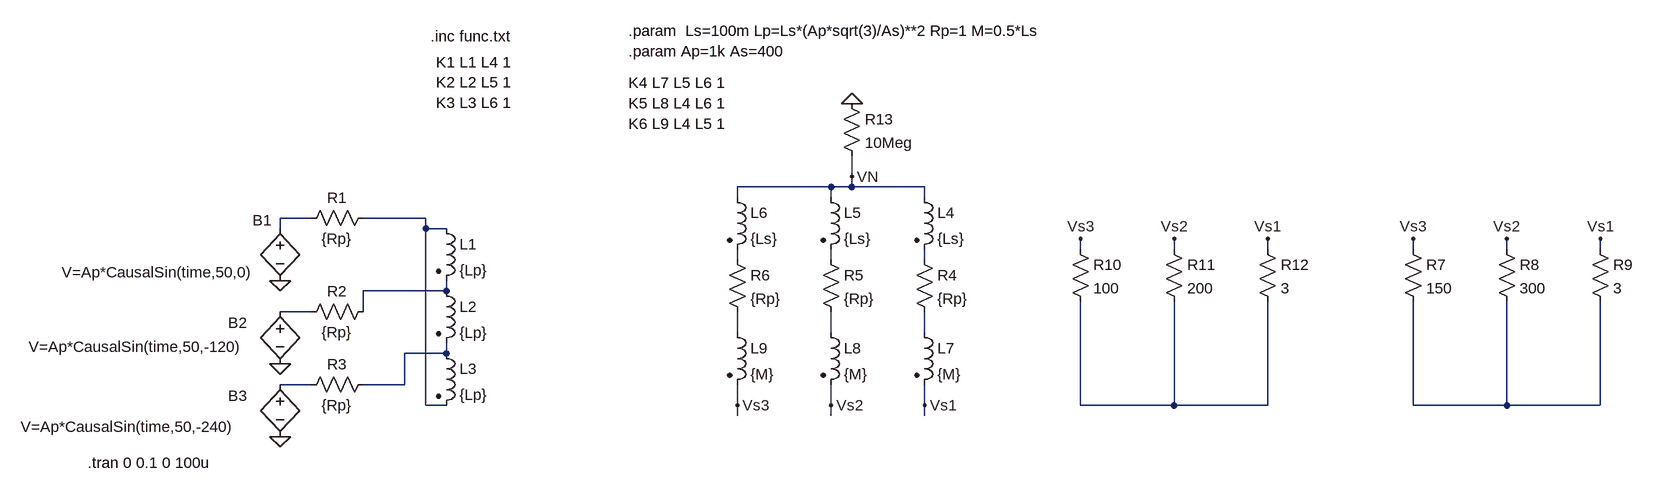
[diagram p0: schematic TransfoTri-Self.asc]
TransfoTri-Self.asc, the LTspice schematic file:
Version 4
SHEET 1 1560 924
WIRE 352 -64 352 -96
WIRE 320 -48 176 -48
WIRE 352 -48 352 -64
WIRE 352 -48 320 -48
WIRE 464 -48 352 -48
WIRE 176 -32 176 -48
WIRE 320 -32 320 -48
WIRE 464 -32 464 -48
WIRE -480 0 -528 0
WIRE -304 0 -400 0
WIRE -528 16 -528 0
WIRE -304 16 -304 0
WIRE -272 16 -304 16
WIRE 704 48 704 32
WIRE 848 48 848 32
WIRE 992 48 992 32
WIRE 1216 48 1216 32
WIRE 1360 48 1360 32
WIRE 1504 48 1504 32
WIRE 176 64 176 48
WIRE 320 64 320 48
WIRE 464 64 464 48
WIRE -272 112 -272 96
WIRE -272 112 -400 112
WIRE -480 144 -528 144
WIRE -400 144 -400 112
WIRE 176 176 176 144
WIRE 320 176 320 144
WIRE 464 176 464 144
WIRE -272 208 -272 192
WIRE -272 208 -336 208
WIRE -480 256 -528 256
WIRE -336 256 -336 208
WIRE -336 256 -400 256
WIRE -304 288 -304 16
WIRE -272 288 -304 288
WIRE 176 288 176 256
WIRE 320 288 320 256
WIRE 464 288 464 256
WIRE 704 288 704 128
WIRE 848 288 848 128
WIRE 848 288 704 288
WIRE 992 288 992 128
WIRE 992 288 848 288
WIRE 1216 288 1216 128
WIRE 1360 288 1360 128
WIRE 1360 288 1216 288
WIRE 1504 288 1504 128
WIRE 1504 288 1360 288
WIRE 176 304 176 288
WIRE 320 304 320 288
WIRE 464 304 464 288
FLAG -528 96 0
FLAG -528 224 0
FLAG -528 336 0
FLAG 464 288 Vs1
FLAG 320 288 Vs2
FLAG 176 288 Vs3
FLAG 992 32 Vs1
FLAG 848 32 Vs2
FLAG 704 32 Vs3
FLAG 1504 32 Vs1
FLAG 1360 32 Vs2
FLAG 1216 32 Vs3
FLAG 352 -64 VN
FLAG 352 -176 0
SYMBOL ind2 -288 0 R0
SYMATTR InstName L1
SYMATTR Value {Lp}
SYMATTR Type ind
SYMATTR SpiceLine Rser=1
SYMBOL ind2 -288 96 R0
SYMATTR InstName L2
SYMATTR Value {Lp}
SYMATTR Type ind
SYMATTR SpiceLine Rser=1
SYMBOL ind2 -288 192 R0
SYMATTR InstName L3
SYMATTR Value {Lp}
SYMATTR Type ind
SYMATTR SpiceLine Rser=1
SYMBOL bv -528 0 R0
WINDOW 0 -42 3 Left 2
WINDOW 3 -336 83 Left 2
SYMATTR InstName B1
SYMATTR Value V=Ap*CausalSin(time,50,0)
SYMBOL bv -528 128 R0
WINDOW 0 -80 33 Left 2
WINDOW 3 -387 70 Left 2
SYMATTR InstName B2
SYMATTR Value V=Ap*CausalSin(time,50,-120)
SYMBOL bv -528 240 R0
WINDOW 0 -80 33 Left 2
WINDOW 3 -399 81 Left 2
SYMATTR InstName B3
SYMATTR Value V=Ap*CausalSin(time,50,-240)
SYMBOL res -384 -16 R90
WINDOW 0 0 56 VBottom 2
WINDOW 3 32 56 VTop 2
SYMATTR InstName R1
SYMATTR Value {Rp}
SYMBOL res -384 128 R90
WINDOW 0 0 56 VBottom 2
WINDOW 3 32 56 VTop 2
SYMATTR InstName R2
SYMATTR Value {Rp}
SYMBOL res -384 240 R90
WINDOW 0 0 56 VBottom 2
WINDOW 3 32 56 VTop 2
SYMATTR InstName R3
SYMATTR Value {Rp}
SYMBOL ind2 448 -48 R0
SYMATTR InstName L4
SYMATTR Value {Ls}
SYMATTR Type ind
SYMBOL ind2 304 -48 R0
SYMATTR InstName L5
SYMATTR Value {Ls}
SYMATTR Type ind
SYMBOL ind2 160 -48 R0
SYMATTR InstName L6
SYMATTR Value {Ls}
SYMATTR Type ind
SYMBOL res 448 48 R0
SYMATTR InstName R4
SYMATTR Value {Rp}
SYMBOL res 304 48 R0
SYMATTR InstName R5
SYMATTR Value {Rp}
SYMBOL res 160 48 R0
SYMATTR InstName R6
SYMATTR Value {Rp}
SYMBOL res 688 32 R0
SYMATTR InstName R10
SYMATTR Value 100
SYMBOL res 832 32 R0
SYMATTR InstName R11
SYMATTR Value 200
SYMBOL res 976 32 R0
SYMATTR InstName R12
SYMATTR Value 3
SYMBOL res 1200 32 R0
SYMATTR InstName R7
SYMATTR Value 150
SYMBOL res 1344 32 R0
SYMATTR InstName R8
SYMATTR Value 300
SYMBOL res 1488 32 R0
SYMATTR InstName R9
SYMATTR Value 3
SYMBOL res 336 -192 R0
SYMATTR InstName R13
SYMATTR Value 10Meg
SYMBOL ind2 160 160 R0
SYMATTR InstName L9
SYMATTR Value {M}
SYMATTR Type ind
SYMBOL ind2 304 160 R0
SYMATTR InstName L8
SYMATTR Value {M}
SYMATTR Type ind
SYMBOL ind2 448 160 R0
SYMATTR InstName L7
SYMATTR Value {M}
SYMATTR Type ind
TEXT -824 376 Left 2 !.tran 0 0.1 0 100u
TEXT 8 -288 Left 2 !.param  Ls=100m Lp=Ls*(Ap*sqrt(3)/As)**2 Rp=1 M=0.5*Ls\n.param Ap=1k As=400
TEXT -296 -280 Left 2 !.inc func.txt
TEXT -288 -240 Left 2 !K1 L1 L4 1\nK2 L2 L5 1\nK3 L3 L6 1
TEXT 8 -208 Left 2 !K4 L7 L5 L6 1\nK5 L8 L4 L6 1\nK6 L9 L4 L5 1

The netlist it stands for:
* TransfoTri-Self.asc
L1 N002 N006 {Lp} Rser=1
L2 N006 N011 {Lp} Rser=1
L3 N011 N002 {Lp} Rser=1
B1 N001 0 V=Ap*CausalSin(time,50,0)
B2 N007 0 V=Ap*CausalSin(time,50,-120)
B3 N012 0 V=Ap*CausalSin(time,50,-240)
R1 N002 N001 {Rp}
R2 N006 N007 {Rp}
R3 N011 N012 {Rp}
L4 VN N005 {Ls}
L5 VN N004 {Ls}
L6 VN N003 {Ls}
R4 N005 N010 {Rp}
R5 N004 N009 {Rp}
R6 N003 N008 {Rp}
R10 Vs3 N013 100
R11 Vs2 N013 200
R12 Vs1 N013 3
R7 Vs3 N014 150
R8 Vs2 N014 300
R9 Vs1 N014 3
R13 0 VN 10Meg
L9 N008 Vs3 {M}
L8 N009 Vs2 {M}
L7 N010 Vs1 {M}
.tran 0 0.1 0 100u
.param  Ls=100m Lp=Ls*(Ap*sqrt(3)/As)**2 Rp=1 M=0.5*Ls
.param Ap=1k As=400
.inc func.txt
K1 L1 L4 1
K2 L2 L5 1
K3 L3 L6 1
K4 L7 L5 L6 1
K5 L8 L4 L6 1
K6 L9 L4 L5 1
.backanno
.end